# Altium schematic sheet ConnectorsBoard.SchDoc
size A2
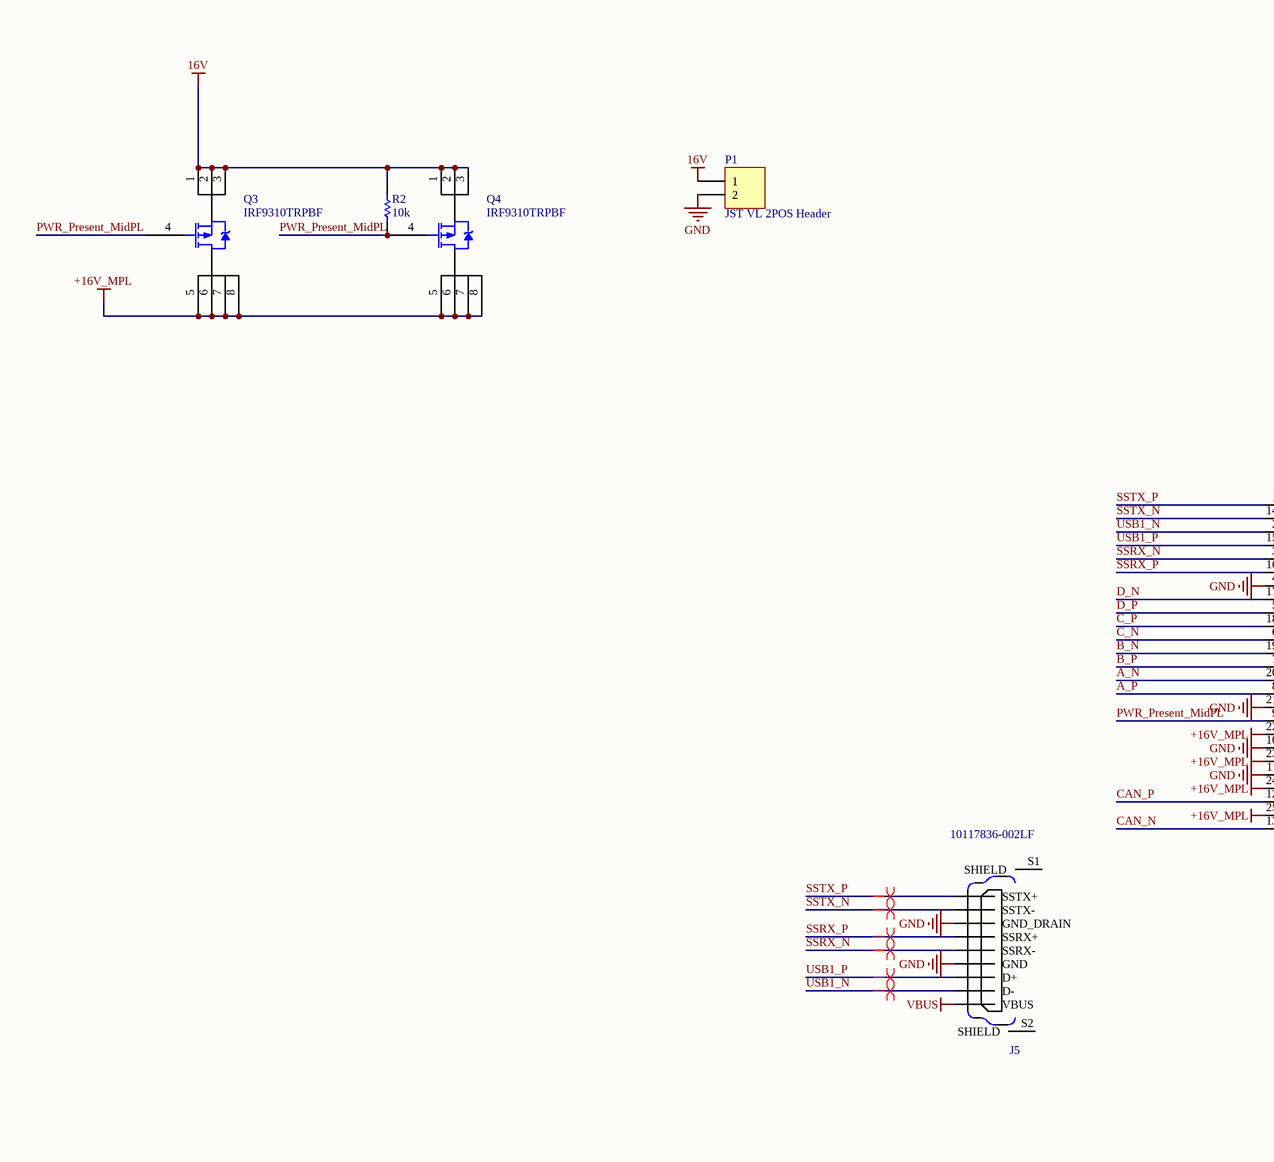
[diagram p0: ConnectorsBoard.SchDoc, left]
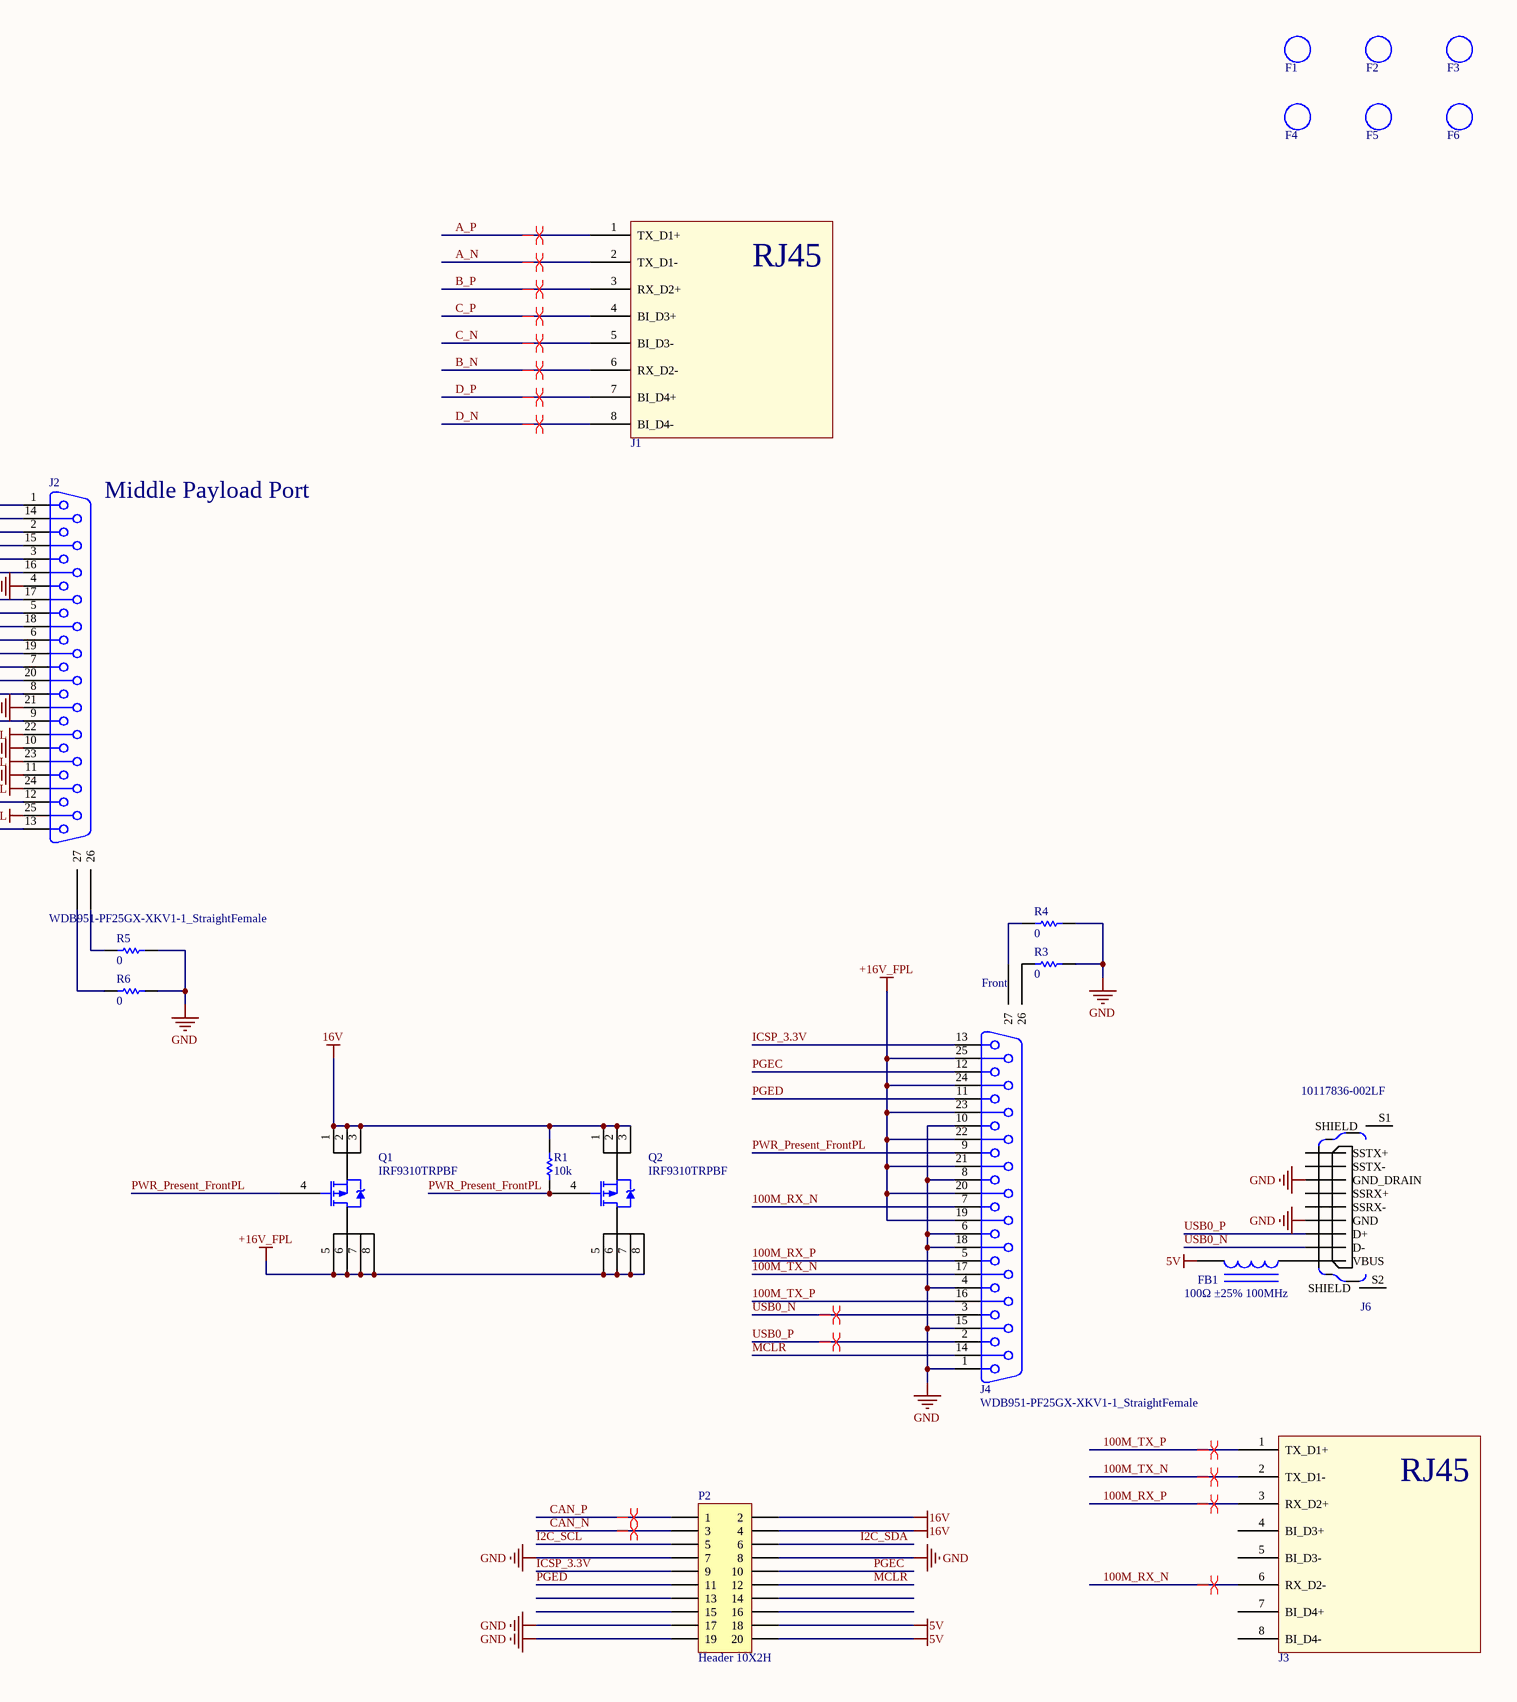
[diagram p1: ConnectorsBoard.SchDoc, right]

## Parts
F1  Fiducial, .040"  [FIDUCIAL, .040"]  (value not drawn)  (no BOM)
F2  Fiducial, .040"  [FIDUCIAL, .040"]  (value not drawn)  (no BOM)
F3  Fiducial, .040"  [FIDUCIAL, .040"]  (value not drawn)  (no BOM)
F4  Fiducial, .040"  [FIDUCIAL, .040"]  (value not drawn)  (no BOM)
F5  Fiducial, .040"  [FIDUCIAL, .040"]  (value not drawn)  (no BOM)
F6  Fiducial, .040"  [FIDUCIAL, .040"]  (value not drawn)  (no BOM)
FB1  100Ω ±25% 100MHz  [0805_L]
J1  Jack Modular Connector 8p8c (RJ45, Ethernet) Vertical Unshielded Cat3  [RJ45-5556416-1]  (value not drawn)
J2  WDB951-PF25GX-XKV1-1_StraightFemale  [WDB951-PF25GX-XKV1-1_StraightFemale]
J3  Jack Modular Connector 8p8c (RJ45, Ethernet) Vertical Unshielded Cat3  [RJ45-5556416-1]  (value not drawn)
J4  WDB951-PF25GX-XKV1-1_StraightFemale  [WDB951-PF25GX-XKV1-1_StraightFemale]
J5  10117836-002LF  [AMPHENOL_10117836-002LF_10117836-002LF(Primary)]
J6  10117836-002LF  [AMPHENOL_10117836-002LF_10117836-002LF(Primary)]
P1  JST VL 2POS Header  [JST-VL-2POS]
P2  Header 10X2H  [HDR_2X10]
Q1  IRF9310TRPBF  [SOIC-SN8_M]
Q2  IRF9310TRPBF  [SOIC-SN8_M]
Q3  IRF9310TRPBF  [SOIC-SN8_M]
Q4  IRF9310TRPBF  [SOIC-SN8_M]
R1  value 10k  [RES0805N]  (hidden comment: Res 0805)
R2  value 10k  [RES0805N]  (hidden comment: Res 0805)
R3  value 0  [RES0805N]  (hidden comment: Res 0805)
R4  value 0  [RES0805N]  (hidden comment: Res 0805)
R5  value 0  [RES0805N]  (hidden comment: Res 0805)
R6  value 0  [RES0805N]  (hidden comment: Res 0805)

## Nets
5V: FB1.2 P2.18 P2.20
16V: P1.1 P2.2 P2.4 Q1.1(G) Q1.2(D) Q1.3(S) Q2.1(G) Q2.2(D) Q2.3(S) Q3.1(G) Q3.2(D) Q3.3(S) Q4.1(G) Q4.2(D) Q4.3(S) R1.2 R2.2
+16V_FPL: J4.19 J4.20 J4.21 J4.22 J4.23 J4.24 J4.25 Q1.5 Q1.6 Q1.7 Q1.8 Q2.5 Q2.6 Q2.7 Q2.8
+16V_MPL: J2.22 J2.23 J2.24 J2.25 Q3.5 Q3.6 Q3.7 Q3.8 Q4.5 Q4.6 Q4.7 Q4.8
GND: J2.4 J2.10 J2.11 J2.21 J4.1 J4.4 J4.6 J4.8 J4.10 J4.15 J4.18 J5.4(GND) J5.7(GND_DRAIN) J6.4(GND) J6.7(GND_DRAIN) P1.2 P2.7 P2.8 P2.17 P2.19 R3.2 R4.2 R5.2 R6.2
VBUS: J5.1(VBUS)
100M_RX_N: J3.6(RX_D2-) J4.7
100M_RX_P: J3.3(RX_D2+) J4.5
100M_TX_N: J3.2(TX_D1-) J4.17
100M_TX_P: J3.1(TX_D1+) J4.16
A_N: J1.2(TX_D1-) J2.20
A_P: J1.1(TX_D1+) J2.8
B_N: J1.6(RX_D2-) J2.19
B_P: J1.3(RX_D2+) J2.7
C_N: J1.5(BI_D3-) J2.6
C_P: J1.4(BI_D3+) J2.18
CAN_N: J2.13 P2.3
CAN_P: J2.12 P2.1
D_N: J1.8(BI_D4-) J2.17
D_P: J1.7(BI_D4+) J2.5
I2C_SCL: P2.5
I2C_SDA: P2.6
ICSP_3.3V: J4.13 P2.9
MCLR: J4.14 P2.12
PGEC: J4.12 P2.10
PGED: J4.11 P2.11
PWR_Present_FrontPL: J4.9 Q1.4 Q2.4 R1.1
PWR_Present_MidPL: J2.9 Q3.4 Q4.4 R2.1
SSRX_N: J2.3 J5.5(SSRX-)
SSRX_P: J2.16 J5.6(SSRX+)
SSTX_N: J2.14 J5.8(SSTX-)
SSTX_P: J2.1 J5.9(SSTX+)
USB0_N: J4.3 J6.2(D-)
USB0_P: J4.2 J6.3(D+)
USB1_N: J2.2 J5.2(D-)
USB1_P: J2.15 J5.3(D+)
NetFB1_1: FB1.1 J6.1(VBUS)
NetJ2_26: J2.26 R5.1
NetJ2_27: J2.27 R6.1
NetJ4_26: J4.26 R3.1
NetJ4_27: J4.27 R4.1

Not connected (* = marked no-connect by the designer): J3 4(BI_D3+) 5(BI_D3-) 7(BI_D4+) 8(BI_D4-); J5 S1(SHIELD) S2(SHIELD); J6 5(SSRX-) 6(SSRX+) 8(SSTX-) 9(SSTX+) S1(SHIELD) S2(SHIELD); P2 13 14 15 16

## Layout directives
differential pair: 100M_RX_N, 100M_RX_P, 100M_TX_N, 100M_TX_P, A_N, A_P, B_N, B_P, C_N, C_P, CAN_N, CAN_P, D_N, D_P, SSRX_N, SSRX_P, SSTX_N, SSTX_P, USB0_N, USB0_P, USB1_N, USB1_P

## Notes on the sheet
- (near J2) Middle Payload Port
- (near J4) Front
- (in symbol 5556416-1) RJ45

## Library data of the parts
F1-F6 = Fiducial, .040": Designator: F?; Part Number: Fiducial, .040"; Component Type: Standard (No BOM)
FB1 = 0805 100Ω 25% 100MHz: 贴片磁珠; ComponentLink1Description: 供应商链接; ComponentLink1URL: http://www.szlcsc.com/product/details_1367.html; Package: 0805; Supplier: LC; SuppliersPartNumber: C1015
J1 J3 = 5556416-1: RJ45 connector 180 degrees; Manufacturer: TE; Unit Price in Quantity: .5722; Part Number: 5556416-1; Mounting Type: thru-hole; Package: Header; Component Type: Standard; Pin Count: 8; Manufacturer Part Number: 5556416-1; Supplier 1: Digikey; Supplier 1 Part Number: A31428-ND; Unit Price-Supplier 1: 1.04; Price Break: 1000; Vendor/Distributor: Digikey
J5 J6 = 10117836-002LF: Usb, 3.0 Type A, Receptacle, SMT; Manufacturer: Amphenol FCI; Package: None; Manufacturer Part Number: 10117836-002LF; Digi-Key_Purchase_URL: https://www.digikey.com/product-detail/en/amphenol-fci/10117836-002LF/609-4660-ND/3641378?utm_source=snapeda&utm_medium=aggregator&utm_campaign=symbol; SnapEDA_Link: https://www.snapeda.com/parts/10117836-002LF/Amphenol%20FCI/view-part/?ref=snap; Digi-Key_Part_Number: 609-4660-ND; Value: *
P1 = CONN HEADER 2POS VL SERIES TIN: Manufacturer: JST Sales America Inc; Manufacturer Part Number: B02P-VL; Unit Price in Quantity: 0.3104; Part Number: CONN HEADER 2POS VL SERIES TIN; Mounting Type: thru-hole; Package: header; Component Type: Standard; Pin Count: 2; Supplier 1: Digikey; Supplier 1 Part Number: 455-2361-ND; Price Break: 1000; Vendor/Distributor: Digikey
P2 = Header 10X2H: Header, 10-Pin, Dual row, Right Angle; Manufacturer Part Number: AWHW 10G-0202-T; Manufacturer: Assmann WSW Components; LatestRevisionDate: 17-Jul-2002; LatestRevisionNote: Re-released for DXP Platform.; Publisher: Altium Limited
Q1-Q4 = IRF9310TRPBF: MOSFET P-CH 30V 20A 8-SOIC; Manufacturer: International Rectifier; Unit Price in Quantity: 0.7271; Part Number: IRF9310TRPBF; Mounting Type: smt; Component Kind: P Channel MOSFET; Component Type: Standard; PackageDescription: SOIC-SN8_M; Manufacturer Part Number: IRF9310TRPBF; Package: SOIC-8; Supplier 1: Digikey; Supplier 1 Part Number: IRF9310TRPBFCT-ND; Unit Price-Supplier 1: 1.94; Price Break: 1000; Vendor/Distributor: Digikey
R1 R2 = RES 10.0K OHM 1/8W 1% 0805 SMD: Manufacturer: Panasonic - ECG; Manufacturer Part Number: ERJ-6ENF1002V; Unit Price in Quantity: .005; Part Number: RES 10.0K OHM 1/8W 1% 0805 SMD; Mounting Type: smt; Package: 0805; Component Type: Standard; Supplier 1: Digikey; Supplier 1 Part Number: P10.0KCCT-ND; Unit Price-Supplier 1: .07; Vendor/Distributor: Digikey; Price Break: 5000
R3-R6 = RES 0.0 OHM 1/8W 0805 SMD: Manufacturer: Stackpole Electronics Inc; Manufacturer Part Number: RMCF0805ZT0R00; Unit Price in Quantity: .0019; Part Number: RES 0.0 OHM 1/8W 0805 SMD; Mounting Type: smt; Package: 0805; Component Type: Standard; Supplier 1: Digikey; Supplier 1 Part Number: RMCF0805ZT0R00CT-ND; Unit Price-Supplier 1: .03; Vendor/Distributor: Digikey; Price Break: 5000
J2 J4 = WDB951-PF25GX-XKV1-1_StraightFemale: Part Number: WDB951-PF25GX-XKV1-1_StraightFemale; Mounting Type: thru-hole; Package: header; Component Type: Standard; Pin Count: 25